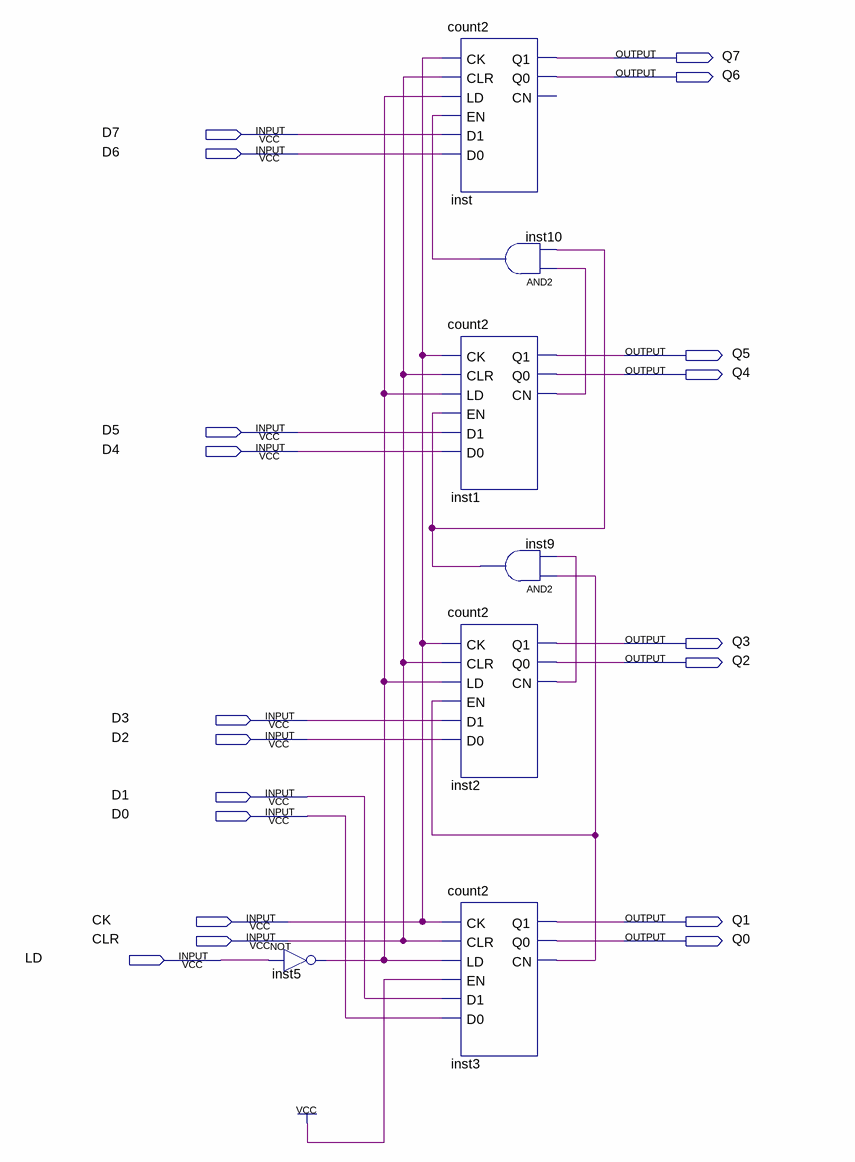
[diagram p0: schematic sheet]
// Quartus schematic count8.bdf as structural Verilog: 7 symbols, 19 pins
module count8 (
  input  D7,
  input  D6,
  input  D5,
  input  D4,
  input  D3,
  input  D2,
  input  D1,
  input  D0,
  input  CK,
  input  CLR,
  input  LD,
  output Q7,
  output Q6,
  output Q5,
  output Q4,
  output Q3,
  output Q2,
  output Q1,
  output Q0
);

  wire inst1_cn, inst2_cn, inst3_cn, inst5_out, inst9_out, inst10_out;

  not inst5 (inst5_out, LD);
  count2 inst (.CK(CK), .CLR(CLR), .LD(inst5_out), .EN(inst10_out), .D1(D7), .D0(D6), .Q1(Q7), .Q0(Q6));  // open: CN
  count2 inst1 (.CK(CK), .CLR(CLR), .LD(inst5_out), .EN(inst9_out), .D1(D5), .D0(D4), .Q1(Q5), .Q0(Q4), .CN(inst1_cn));
  count2 inst2 (.CK(CK), .CLR(CLR), .LD(inst5_out), .EN(inst3_cn), .D1(D3), .D0(D2), .Q1(Q3), .Q0(Q2), .CN(inst2_cn));
  count2 inst3 (.CK(CK), .CLR(CLR), .LD(inst5_out), .EN(1'b1), .D1(D1), .D0(D0), .Q1(Q1), .Q0(Q0), .CN(inst3_cn));
  and inst10 (inst10_out, inst1_cn, inst9_out);
  and inst9 (inst9_out, inst3_cn, inst2_cn);
endmodule
